# EAGLE design Shutter Hall Sensors Test (EAGLE 9.0.1)
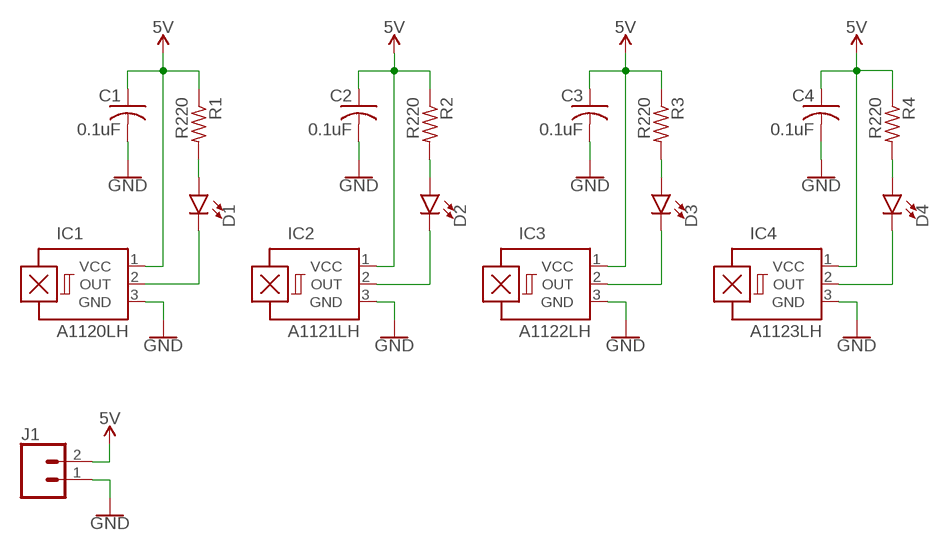
[diagram p0: schematic, sheet 1]

## Parts
C1  0.1uF  C-USC0805  [C0805]
C2  0.1uF  C-USC0805  [C0805]
C3  0.1uF  C-USC0805  [C0805]
C4  0.1uF  C-USC0805  [C0805]
D1  LED5MM  [LED_5MM]
D2  LED5MM  [LED_5MM]
D3  LED5MM  [LED_5MM]
D4  LED5MM  [LED_5MM]
IC1  A1120LH  A1203LH  [SOT23-W]
IC2  A1121LH  A1203LH  [SOT23-W]
IC3  A1122LH  A1203LH  [SOT23-W]
IC4  A1123LH  A1203LH  [SOT23-W]
J1  CONN_02  [1X02]
R1  R220  R-US_R0805  [R0805]
R2  R220  R-US_R0805  [R0805]
R3  R220  R-US_R0805  [R0805]
R4  R220  R-US_R0805  [R0805]

## Nets
5V: C1.1 C2.1 C3.1 C4.1 IC1.1(VCC) IC2.1(VCC) IC3.1(VCC) IC4.1(VCC) J1.2 R1.1 R2.1 R3.1 R4.1
GND: C1.2 C2.2 C3.2 C4.2 IC1.3(GND) IC2.3(GND) IC3.3(GND) IC4.3(GND) J1.1
N$1: D4.A R4.2
N$2: D3.K(C) IC3.2(OUT)
N$3: D4.K(C) IC4.2(OUT)
N$5: D1.A R1.2
N$6: D2.K(C) IC2.2(OUT)
N$7: D2.A R2.2
N$8: D1.K(C) IC1.2(OUT)
N$10: D3.A R3.2

## Library data of the parts
C1-C4 = rcl:C-US: CAPACITOR, American symbol; SPICEPREFIX: C
D1-D4 = SparkFun-LED:LED: LED (Generic) Standard schematic elements and footprints for 5mm, 3mm, 1206, and 0603 sized LEDs. Generic LEDs with no color specified.
IC1-IC4 = allegro:A12*?: Hall-effect bipolar switch Source: http://www.allegromicro.com/en/Products/Part_Numbers/1202/1202.pdf; MF: ALLEGRO MICROSYSTEMS, INC.; MPN: A1203LLHLT-T; OC_FARNELL: 1791384; OC_NEWARK: 31K6608
J1 = SparkFun-Connectors:CONN_02: Multi connection point. Often used as Generic Header-pin footprint for 0.1 inch spaced/style header connections On any of the 0.1 inch spaced packages, you can populate with these: Break Away Headers - Straight <https://www.sparkfun.com/products/116> (PRT-00116) Break Away Male Headers - Right Angle <https://www.sparkfun.com/products/553> (PRT-00553) Female Headers <https://www.sparkfun.com/products/115> (PRT-00115) Break Away Headers - Machine Pin <https://www.sparkfun.com/products/117> (PRT-00117) Break Away Female Headers - Swiss Machine Pin <https://www.sparkfun.com/products/743> (PRT-00743) For SCREWTERMINALS and SPRING TERMINALS visit here: Screw Terimnals on SparkFun.com <https://www.sparkfun.com/search/results?term=Screw+Terminals> (5mm/3.5mm/2.54mm spacing) This device is also useful as a general connection point to wire up your design to another part of your project. Our various solder wires solder well into these plated through hole pads. Hook-Up Wire - Assortment (Stranded, 22 AWG) <https://www.sparkfun.com/products/11375> (PRT-11375) Hook-Up Wire - Assortment (Solid Core, 22 AWG) <https://www.sparkfun.com/products/11367> (PRT-11367) View the entire wire category on our website here <https://www.sparkfun.com/categories/141> Special notes: Molex polarized connector foot print use with: PRT-08233 with associated crimp pins and housings. 2.54_SCREWTERM for use with PRT-10571. 3.5mm Screw Terminal footprints for PRT-08084 5mm Screw Terminal footprints for use with PRT-08432
R1-R4 = rcl:R-US_: RESISTOR, American symbol; SPICEPREFIX: R

## Board
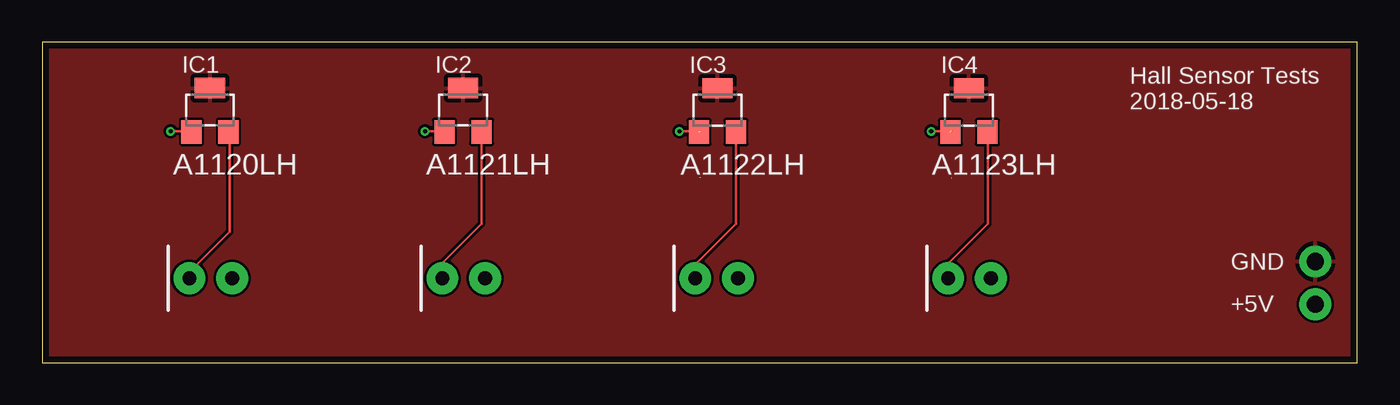
[diagram p1: board, top side]
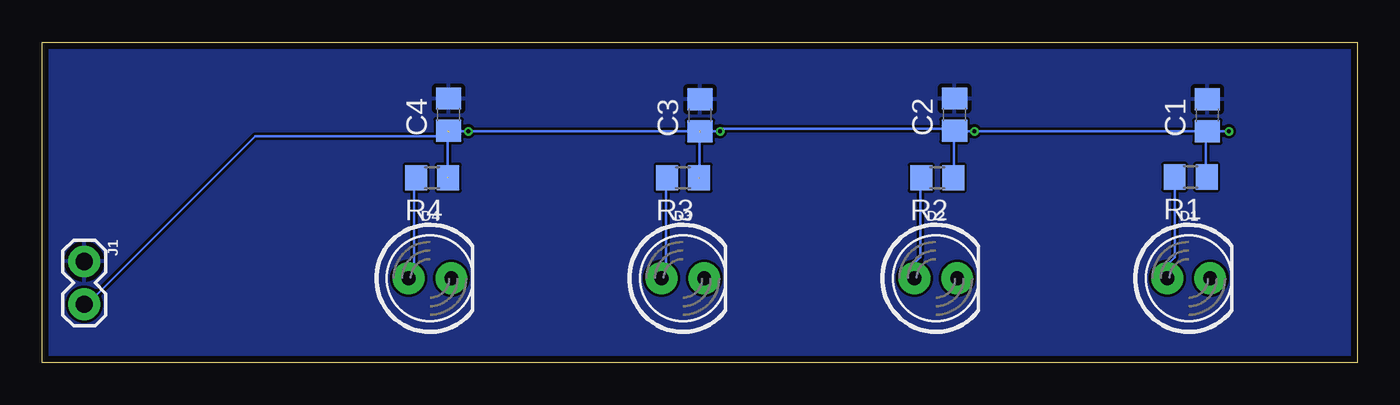
[diagram p2: board, bottom side, seen from below]

Size 78 x 19 mm. Coordinates in mm from the lower left corner, seen from the top.
Outline: 0,0 78,0 78,19 0,19 0,0
Copper layers (1*16): Top 0.035559375mm / dielectric 1.6mm / Bottom 0.035559375mm
Design rules "oshpark-2layer": minimum track width 6mil, minimum drill 10mil, track to track 6mil, track to pad 6mil, pad to pad 6mil, via to via 6mil, smd to smd 6mil, copper to edge 15mil, drill to drill 6mil, minimum pad ring 5mil, minimum via ring 5mil, stop-mask expansion 2.5mil, vias tented up to drill 0mil, thermal gap 10mil

### Footprints (pad centres in the part's own frame; a part is rotated, then mirrored left to right if it is on the bottom)
C0805 = smd 1.3 x 1.5: 1 -0.95,0; 2 0.95,0
LED_5MM = drill 0.813 pad 1.88: A -1.27,0; K 1.27,0
SOT23-W = smd 1.2 x 1.4: 1 -1.1,-1.3; 2 1.1,-1.3 | smd 1.8 x 1.2: 3 0,1.3
1X02 = drill 1.016 pad 1.88: 1 0,0; 2 2.54,0
R0805 = smd 1.3 x 1.5: 1 -0.95,0; 2 0.95,0

### Placement (x,y rotation side)
C1  8.9,14.66 90 bottom
C2  23.89,14.71 90 bottom
C3  38.99,14.66 90 bottom
C4  53.89,14.71 90 bottom
D1  10,5 0 bottom
D2  25,5 0 bottom
D3  40,5 0 bottom
D4  55,5 0 bottom
IC1  9.95,14.98 0 top
IC2  24.96,14.98 0 top
IC3  40.05,14.97 0 top
IC4  54.96,14.97 0 top
J1  75.5,6 270 bottom
R1  9.89,11.01 180 bottom
R2  24.91,10.96 180 bottom
R3  39.99,10.96 180 bottom
R4  54.87,10.96 180 bottom

### Tracks (layer width: path | path; a pad name or v marks a point on that pad's centre or on a via)
5V  (via drill 0.25)  (6 unrouted)
  Top 0.152: v7.62,13.72 8.84,13.72 IC1.1 | v22.71,13.72 23.77,13.72 IC2.1 | v52.73,13.72 53.8,13.72 IC4.1 | v37.8,13.72 38.86,13.72 IC3.1
  Bottom 0.152: v7.62,13.72 8.84,13.72 C1.1 | R1.1 8.99,11.12 8.99,13.56 C1.1 | C2.1 23.77,13.72 v22.71,13.72 8.99,13.72 C1.1 | R2.1 23.93,10.97 23.93,13.72 C2.1 | 53.8,13.72 v52.73,13.72 39.01,13.72 | 53.95,13.72 53.95,13.41 | 53.95,13.41 53.95,10.97 | 38.86,13.72 v37.8,13.72 37.64,13.87 23.93,13.87 C2.1 | 53.95,13.41 65.38,13.41 74.83,3.96 74.98,3.96 75.44,3.5 J1.2 | 39.01,10.97 39.01,13.56 C3.1
GND
  pour Top: 0,0 0,19 78,19 78,0
  pour Bottom: 0,0 0,19 78,19 78,0
N$1
  Bottom 0.152: R4.2 55.93,10.82 55.93,5.33 56.24,5.03 D4.A
N$2
  Top 0.152: IC3.2 41.15,13.56 41.15,8.23 38.86,5.94 38.86,5.03 D3.K
N$3
  Top 0.152: IC4.2 56.08,13.56 56.08,8.23 53.8,5.94 53.8,5.03 D4.K
N$5
  Bottom 0.152: R1.2 10.82,10.97 10.82,6.25 11.12,5.94 11.12,5.03 D1.A
N$6
  Top 0.152: IC2.2 26.06,13.56 26.06,8.23 23.77,5.94 23.77,5.03 D2.K
N$7
  Bottom 0.152: R2.2 25.91,10.82 25.91,6.25 26.21,5.94 26.21,5.03 D2.A
N$8
  Top 0.152: IC1.2 11.12,13.56 11.12,7.77 8.84,5.49 8.84,5.03 D1.K
N$10
  Bottom 0.152: R3.2 41,10.82 41,5.18 41.15,5.03 D3.A

### Text on the board
tNames: Hall Sensor Tests / 2018-05-18 | GND | +5V